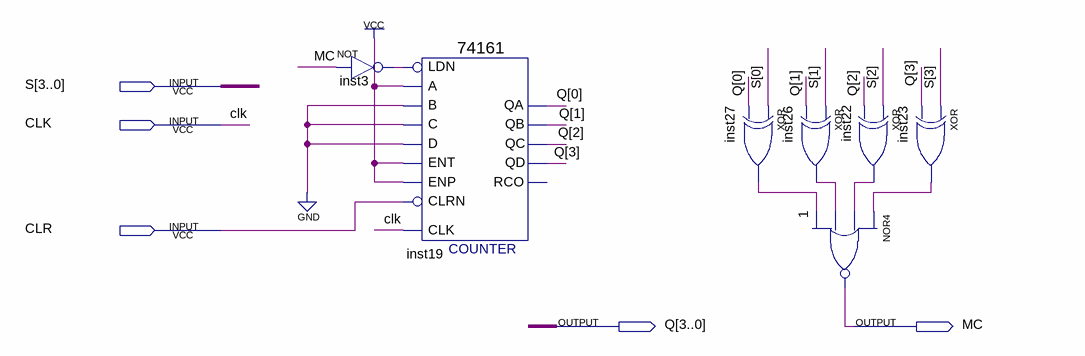
[diagram p0: schematic sheet]
// Quartus schematic SwallowCounter.bdf as structural Verilog: 7 symbols, 5 pins
module SwallowCounter (
  input  [3:0] S,
  input  CLK,
  input  CLR,
  output [3:0] Q,
  output MC
);

  wire inst3_out, inst22_out, inst23_out, inst26_out, inst27_out;

  not inst3 (inst3_out, MC);
  \74161  inst19 (
    .CLRN(CLR), .CLK(CLK), .ENP(1'b1), .LDN(inst3_out), .A(1'b1), .D(1'b0), .ENT(1'b1), .B(1'b0), .C(1'b0),
    .QD(Q[3]), .QC(Q[2]), .QB(Q[1]), .QA(Q[0]));  // open: RCO
  xor inst26 (inst26_out, S[1], Q[1]);
  xor inst27 (inst27_out, S[0], Q[0]);
  nor u_1 (MC, inst23_out, inst22_out, inst26_out, inst27_out);
  xor inst22 (inst22_out, S[2], Q[2]);
  xor inst23 (inst23_out, S[3], Q[3]);
endmodule
